# Altium project TRACTIAN-HW-Challenge.PrjPCB
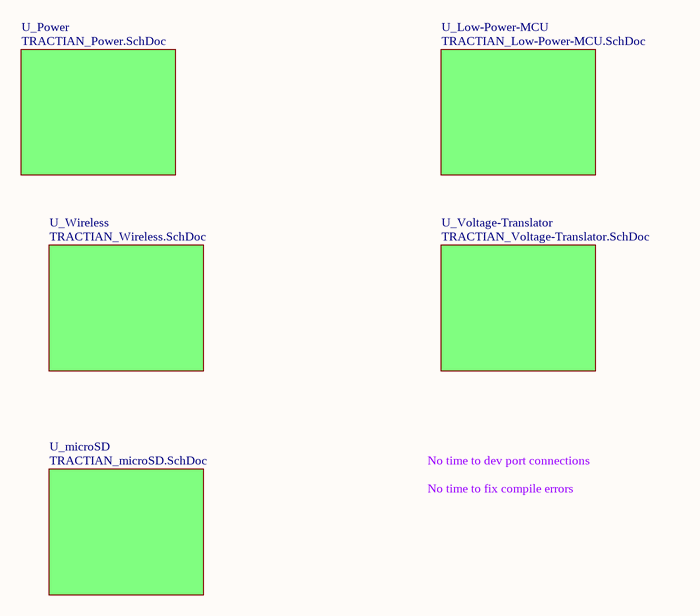
[diagram p0: Blocks.SchDoc]
6 sheets, 56 parts. Net scope: global (net labels, ports and power ports of the same name join across sheets).
Board file: TRACTIAN-HW-Challenge.PcbDoc
Sheets:
  Blocks.SchDoc
    U_Wireless = TRACTIAN_Wireless.SchDoc
    U_Voltage-Translator = TRACTIAN_Voltage-Translator.SchDoc
    U_Power = TRACTIAN_Power.SchDoc
    U_microSD = TRACTIAN_microSD.SchDoc
    U_Low-Power-MCU = TRACTIAN_Low-Power-MCU.SchDoc

## Sheet Blocks.SchDoc
size A

### Sub-sheets
U_Low-Power-MCU = TRACTIAN_Low-Power-MCU.SchDoc: no entries
U_microSD = TRACTIAN_microSD.SchDoc: no entries
U_Power = TRACTIAN_Power.SchDoc: no entries
U_Voltage-Translator = TRACTIAN_Voltage-Translator.SchDoc: no entries
U_Wireless = TRACTIAN_Wireless.SchDoc: no entries

### Notes on the sheet
- No time to dev port connections
- No time to fix compile errors

## Sheet TRACTIAN_Wireless.SchDoc
size A
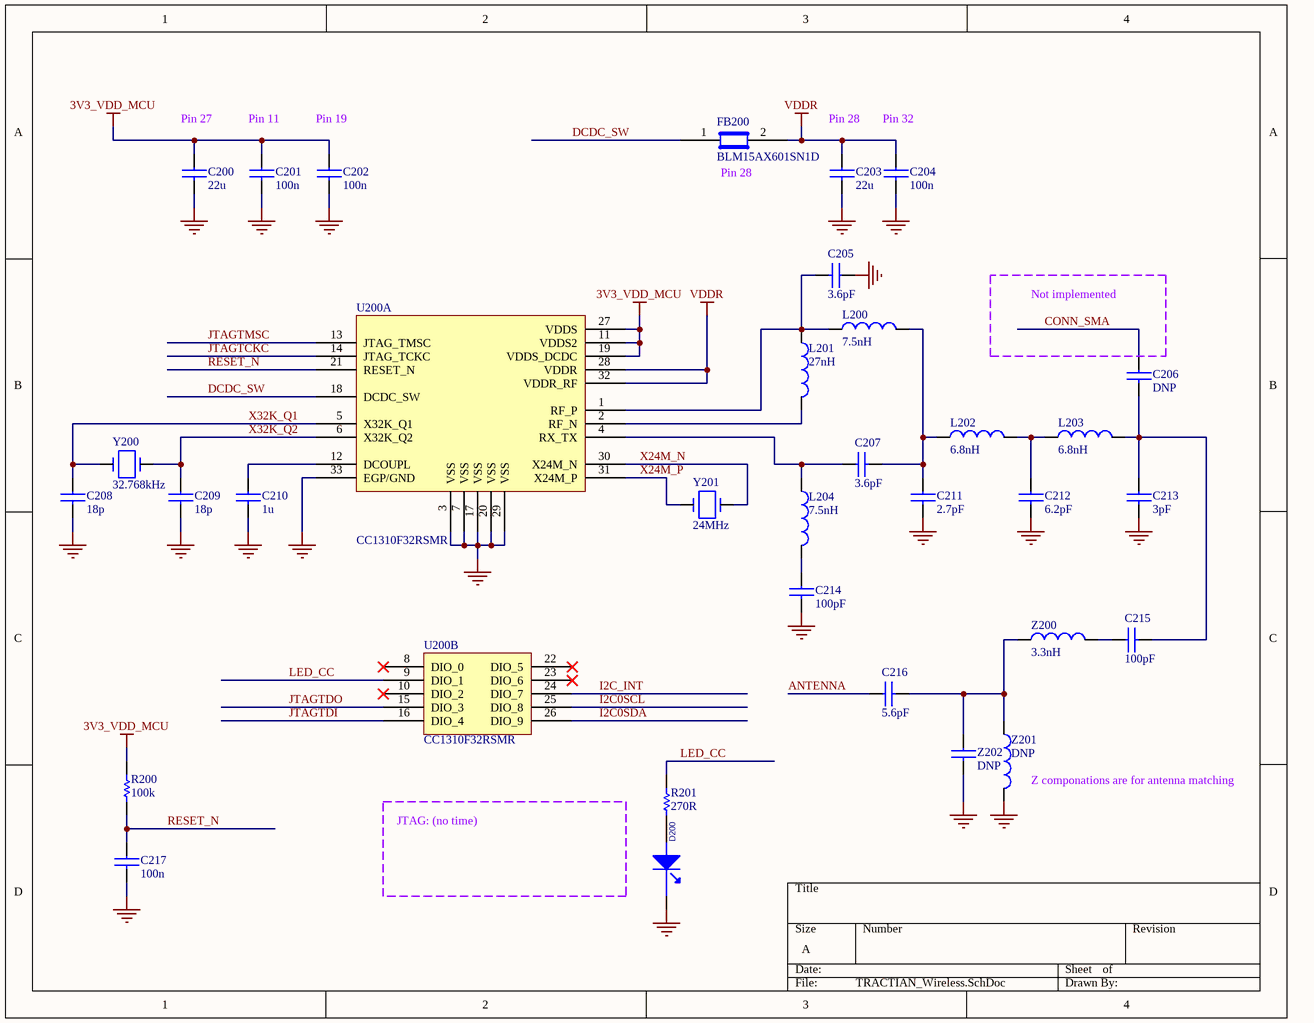
[diagram p1: TRACTIAN_Wireless.SchDoc]

### Parts
C200  22u  [C0805]
C201  100n  [C0402]
C202  100n  [C0402]
C203  22u  [C0805]
C204  100n  [C0402]
C205  3.6pF  [C0402]
C206  DNP  [C0402]
C207  3.6pF  [C0402]
C208  18p  [C0402]
C209  18p  [C0402]
C210  1u  [C0402]
C211  2.7pF  [C0402]
C212  6.2pF  [C0402]
C213  3pF  [C0402]
C214  100pF  [C0402]
C215  100pF  [C0402]
C216  5.6pF  [C0402]
C217  100n  [C0402]
D200  (no value)  [LED_0603]
FB200  BLM15AX601SN1D  [C0402]
L200  7.5nH  [L0402]
L201  27nH  [L0402]
L202  6.8nH  [L0402]
L203  6.8nH  [L0402]
L204  7.5nH  [L0402]
R200  100k  [R0402]
R201  270R  [R0402]
U200  CC1310F32RSMR  [VQFN-32]  (parts A,B of 2)
Y200  32.768kHz  [ABS06]
Y201  24MHz  [ABS06]
Z200  3.3nH  [L0402]
Z201  DNP  [L0402]
Z202  DNP  [C0402]

### Nets
3V3_VDD_MCU: C200.1 C201.1 C202.1 R200.2 U200.11(VDDS2) U200.19(VDDS_DCDC) U200.27(VDDS)
GND: C200.2 C201.2 C202.2 C203.2 C204.2 C205.1 C208.2 C209.2 C210.2 C211.2 C212.2 C213.2 C214.2 C217.2 D200.1(cathode) U200.3(VSS) U200.7(VSS) U200.17(VSS) U200.20(VSS) U200.29(VSS) U200.33(EGP/GND) Z201.2 Z202.2
VDDR: C203.1 C204.1 FB200.2 U200.28(VDDR) U200.32(VDDR_RF)
ANTENNA: C216.1
CONN_SMA: C206.1
DCDC_SW: FB200.1 U200.18(DCDC_SW)
I2C0SCL: U200.25(DIO_8)
I2C0SDA: U200.26(DIO_9)
I2C_INT: U200.24(DIO_7)
JTAGTCKC: U200.14(JTAG_TCKC)
JTAGTDI: U200.16(DIO_4)
JTAGTDO: U200.15(DIO_3)
JTAGTMSC: U200.13(JTAG_TMSC)
LED_CC: R201.2 U200.9(DIO_1)
RESET_N: C217.1 R200.1 U200.21(RESET_N)
X24M_N: U200.30(X24M_N) Y201.2
X24M_P: U200.31(X24M_P) Y201.1
X32K_Q1: C208.1 U200.5(X32K_Q1) Y200.1
X32K_Q2: C209.1 U200.6(X32K_Q2) Y200.2
NetC205_2: C205.2 L200.1 L201.1 U200.1(RF_P)
NetC206_2: C206.2 C213.1 C215.2 L203.2
NetC207_1: C207.1 L204.1 U200.4(RX_TX)
NetC207_2: C207.2 C211.1 L200.2 L202.1
NetC210_1: C210.1 U200.12(DCOUPL)
NetC212_1: C212.1 L202.2 L203.1
NetC214_1: C214.1 L204.2
NetC215_1: C215.1 Z200.2
NetC216_2: C216.2 Z200.1 Z201.1 Z202.1
NetD200_2: D200.2(ANODE) R201.1
NetL201_2: L201.2 U200.2(RF_N)

Not connected (* = marked no-connect by the designer): U200 8(DIO_0)* 10(DIO_2)* 22(DIO_5)* 23(DIO_6)*

### Notes on the sheet
- Pin 27
- Pin 11
- (near C202) Pin 19
- Pin 28
- Pin 32
- (near FB200) Pin 28
- Not implemented
- JTAG: (no time)
- (near Z201) Z componations are for antenna matching

### Library data of the parts
C200 C203 = C2012X5R1C226K: CAP CER 22UF 16V 10% X5R 0805; Manufacturer: TDK Corporation; Capacitance: 22µF; .Checked PCB: RF; Supplier 1: Digi-Key; Supplier Part Number 1: 445-6797-1-ND; Manufacturer Part Number: C2012X5R1C226K; RoHS: RoHS Compliant; Category: Capacitors; Stock 1: 15408; Pricing 1: 1=0.77, 10=0.737, 100=0.3575, 250=0.297, 500=0.2695, 1000=0.2475 (USD); Voltage - Rated: 16V; Tolerance: ±10%; Temperature Coefficient: X5R; Mounting Type: Surface Mount, MLCC; Operating Temperature: -55°C ~ 85°C; Applications: General Purpose; Ratings: -; Package / Case: 0805 (2012 Metric); Size / Dimension: 0.079" L x 0.049" W (2.00mm x 1.25mm); Height - Seated (Max): -; Thickness (Max): 0.057" (1.45mm); Lead Spacing: -; Features: -; Packaging: Cut Tape (CT); Lead Style: -; ComponentLink1URL: http://www.tdk.com/pdf/general_B11.pdf; ComponentLink1Description: http://www.tdk.com/pdf/general_B11.pdf; .Checked SCH: RF
C201 C202 C204 C217 = C1005X5R1H104K: CAP CER .10UF 50V X5R 10% 0402; Manufacturer: TDK Corporation; Capacitance: 0.1µF; Value: 100nF; .Checked PCB: used; Category: Capacitors; Supplier Part Number: 445-5942-1-ND; Manufacturer Part Number: C1005X5R1H104K; Operating Temperature: -55°C ~ 85°C; Package / Case: 0402 (1005 Metric); Price 1k [$]: 0.02340; .Checked SCH: used; Voltage - Rated: 50V; Supplier: Digikey; Supplier 1: Digi-Key; Supplier Part Number 1: 445-5942-1-ND; RoHS: RoHS Compliant; Stock 1: 106926; Pricing 1: 1=0.27, 10=0.18, 100=0.072, 250=0.05176, 500=0.0369, 1000=0.027 (USD); Tolerance: ±10%; Temperature Coefficient: X5R; Mounting Type: Surface Mount, MLCC; Applications: General Purpose; Ratings: -; Size / Dimension: 0.039" L x 0.020" W (1.00mm x 0.50mm); Height - Seated (Max): -; Thickness (Max): 0.022" (0.55mm); Lead Spacing: -; Features: -; Packaging: Cut Tape (CT); Lead Style: -; ComponentLink1URL: http://www.tdk.co.jp/tefe02/e412_c.pdf; ComponentLink1Description: http://www.tdk.co.jp/tefe02/e412_c.pdf
C205-C207 C211-C216 Z202 = Cap: CAPACITOR; ComponentLink1URL: http://www.vishay.com/doc?34104; ComponentLink1Description: http://www.vishay.com/doc?34104
  C205 C207: Value: 3.6pF
  C206 Z202: Value: DNP
  C211: Value: 2.7pF
  C212: Value: 6.2pF
  C213: Value: 3pF
  C214 C215: Value: 100pF
  C216: Value: 5.6pF
C208 C209 = C1005C0G1H180J: CAP CER 18PF 50V C0G 5% 0402; Manufacturer: TDK Corporation; .Checked PCB: used; Temperature Coefficient: C0G, NP0; Capacitance: 18pF; Category: Capacitors; Supplier Part Number: 445-1238-1-ND; Manufacturer Part Number: C1005C0G1H180J; Operating Temperature: -55°C ~ 125°C; Package / Case: 0402 (1005 Metric); Price 1k [$]: 0.00468; Value: 18pF; .Checked SCH: used; Voltage - Rated: 50V; Supplier: Digikey; Supplier 1: Digi-Key; Supplier Part Number 1: 445-1238-1-ND; RoHS: RoHS Compliant; Stock 1: 24321; Pricing 1: 1=0.08, 10=0.05, 100=0.018, 250=0.013, 500=0.0096, 1000=0.0065 (USD); Tolerance: ±5%; Mounting Type: Surface Mount, MLCC; Applications: General Purpose; Ratings: -; Size / Dimension: 0.039" L x 0.020" W (1.00mm x 0.50mm); Height - Seated (Max): -; Thickness (Max): 0.022" (0.55mm); Lead Spacing: -; Features: -; Packaging: Cut Tape (CT); Lead Style: -; ComponentLink1URL: http://www.tdk.co.jp/tefe02/e412_c.pdf; ComponentLink1Description: http://www.tdk.co.jp/tefe02/e412_c.pdf
C210 = C1005X5R1C105K: CAP CER 1.0UF 16V X5R 0402; Manufacturer: TDK Corporation; Capacitance: 1.0µF; Value: 1uF; .Checked PCB: used; Tolerance: ±10%; Category: Capacitors; Manufacturer Part Number: C1005X5R1C105K; Operating Temperature: -55°C ~ 85°C; Package / Case: 0402 (1005 Metric); Price 1k [$]: 0.02080; .Checked SCH: used; Voltage - Rated: 16V; Supplier Part Number: 445-4978-1-ND; Supplier: Digikey; Supplier 1: Digi-Key; Supplier Part Number 1: 445-4978-1-ND; RoHS: RoHS Compliant; Stock 1: 341010; Pricing 1: 1=0.24, 10=0.16, 100=0.064, 250=0.046, 500=0.0328, 1000=0.024 (USD); Temperature Coefficient: X5R; Mounting Type: Surface Mount, MLCC; Applications: General Purpose; Ratings: -; Size / Dimension: 0.039" L x 0.020" W (1.00mm x 0.50mm); Height - Seated (Max): -; Thickness (Max): 0.022" (0.55mm); Lead Spacing: -; Features: -; Packaging: Cut Tape (CT); Lead Style: -; ComponentLink1URL: http://www.tdk.co.jp/tefe02/e412_c.pdf; ComponentLink1Description: http://www.tdk.co.jp/tefe02/e412_c.pdf
D200 = LED: Generic LED 0603
FB200 = BLM15AX601SN1D: FERRITE CHIP 600 OHM 0402 420mA; Manufacturer: Murata Electronics North America; .Checked PCB: used; Impedance @ Frequency: 600 Ohm @ 100MHz; DC Resistance (DCR): 340 mOhm Max; Filter Type: Differential Mode - Single; Number of Lines: 1; .Checked SCH: used; Category: Filters; Supplier Part Number: 490-5441-1-ND; Manufacturer Part Number: BLM15AX601SN1D; Package / Case: 0402 (1005 Metric); Price 1k [$]: 0.03280; Value: BLM15AX601SN1D; Current Rating: 420mA; Supplier: Digikey; Supplier 1: Digi-Key; Supplier Part Number 1: 490-5441-1-ND; RoHS: RoHS Compliant; Stock 1: 34008; Pricing 1: 1=0.26, 10=0.197, 50=0.1148, 100=0.0918, 250=0.0656, 500=0.0446, 1000=0.03608, 5000=0.02821 (USD); Mounting Type: Surface Mount; Packaging: Cut Tape (CT); Height (Max): 0.022" (0.55mm); Size / Dimension: 0.039" L x 0.020" W (1.00mm x 0.50mm); ComponentLink1URL: http://search.murata.co.jp/Ceramy/image/img/PDF/ENG/L0110S0100BLM15AX_SN.pdf; ComponentLink1Description: http://search.murata.co.jp/Ceramy/image/img/PDF/ENG/L0110S0100BLM15AX_SN.pdf
L200-L204 Z200 Z201 = Ind: INDUCTOR; ComponentLink1URL: http://www.vishay.com/doc?34104; ComponentLink1Description: http://www.vishay.com/doc?34104
  L200 L204: Value: 7.5nH
  L201: Value: 27nH
  L202 L203: Value: 6.8nH
  Z200: Value: 3.3nH
  Z201: Value: DNP
R200 = RMCF0402FT100K: RES 100K OHM 1/16W 1% 0402 SMD; Manufacturer: Stackpole Electronics Inc; Power (Watts): 0.063W, 1/16W; .Checked PCB: used; Temperature Coefficient: ±100ppm/°C; Category: Resistors; Supplier Part Number: RMCF0402FT100KCT-ND; Manufacturer Part Number: RMCF0402FT100K; Package / Case: 0402 (1005 Metric); Price 1k [$]: 0.00384; Resistance (Ohms): 100K; Tolerance: ±1%; Value: 100k; .Checked SCH: used; Supplier: Digikey; Supplier 1: Digi-Key; Supplier Part Number 1: RMCF0402FT100KCT-ND; RoHS: RoHS Compliant; Stock 1: 95; Pricing 1: 1=0.04, 10=0.025, 50=0.0138, 100=0.0105, 250=0.0078, 500=0.00576, 1000=0.00384 (USD); Composition: Thick Film; Features: -; Size / Dimension: 0.039" L x 0.020" W (1.00mm x 0.50mm); Height: 0.016" (0.40mm); Number of Terminations: 2; Packaging: Cut Tape (CT); ComponentLink1URL: http://www.seielect.com/Catalog/SEI-RMCF.pdf; ComponentLink1Description: http://www.seielect.com/Catalog/SEI-RMCF.pdf
R201 = Res: Generic resistor; Value: 270R
U200 = CC1310F32RSMR: CC1310 SimpleLink™ Ultra-Low-Power Sub-1 GHz Wireless MCU; Manufacturer Name: Texas Instruments; PN: CC1310F32RGZR; Digikey PN: 296-50997-1-ND; Mouser PN: 595-CC1310F32RGZR
Y200 = ABS06-32.768KHZ-9-1-T: CRYSTAL 32.768 KHZ 9.0 PF SMD; Manufacturer: Abracon Corporation; .Checked PCB: used; Frequency Stability: ±10ppm; Load Capacitance: 9pF; Operating Mode: Fundamental; .Checked SCH: used; Category: Crystals and Oscillators; Supplier Part Number: 535-10247-1-ND; Manufacturer Part Number: ABS06-32.768KHZ-9-1-T; Operating Temperature: -40°C ~ 85°C; Package / Case: 2-SMD, No Lead (DFN, LCC); Price 1k [$]: 1.24500; Value: 32.768kHz; Frequency: 32.768kHz; Supplier: Digikey; Supplier 1: Digi-Key; Supplier Part Number 1: 535-10247-1-ND; RoHS: RoHS Compliant; Stock 1: 5693; Pricing 1: 1=2.81, 10=2.438, 50=2.1376, 100=1.6875, 500=1.425 (USD); Type: kHz Crystal (Tuning Fork); Frequency Tolerance: ±10ppm; Mounting Type: Surface Mount; Size / Dimension: 0.079" L x 0.047" W (2.00mm x 1.20mm); Height: 0.024" (0.60mm); Packaging: Cut Tape (CT); ComponentLink1URL: http://www.abracon.com/Resonators/ABS06.pdf; ComponentLink1Description: http://www.abracon.com/Resonators/ABS06.pdf
Y201 = ABM7-24.000MHZ-D-2-Y-T: CRYSTAL 24.0000MHZ 18PF SMD; Manufacturer: Abracon Corporation; Frequency Stability: ±30ppm; Frequency Tolerance: ±20ppm; ESR (Equivalent Series Resistance): 50 Ohm; Operating Mode: Fundamental; .Creator: MM; .Checked PCB: RF, used by MM; .Checked SCH: MM, checked by RF; Supplier 1: Digi-Key; Manufacturer Part Number: ABM7-24.000MHZ-D-2-Y-T; RoHS: RoHS Compliant; Category: Crystals and Oscillators; Stock 1: 53059; Pricing 1: 1=1.31, 10=1.138, 50=0.9976, 100=0.7875, 500=0.665 (USD); Type: MHz Crystal; Frequency: 24MHz; Load Capacitance: 18pF; Operating Temperature: -40°C ~ 85°C; Ratings: -; Mounting Type: Surface Mount; Package / Case: 2-SMD; Size / Dimension: 0.236" L x 0.138" W (6.00mm x 3.50mm); Height: 0.055" (1.40mm); Packaging: Cut Tape (CT); ComponentLink1URL: http://www.abracon.com/Resonators/abm7.pdf; ComponentLink1Description: http://www.abracon.com/Resonators/abm7.pdf; Supplier Part Number 1: 535-9845-1-ND

## Sheet TRACTIAN_Voltage-Translator.SchDoc
size A

## Sheet TRACTIAN_Power.SchDoc
size A
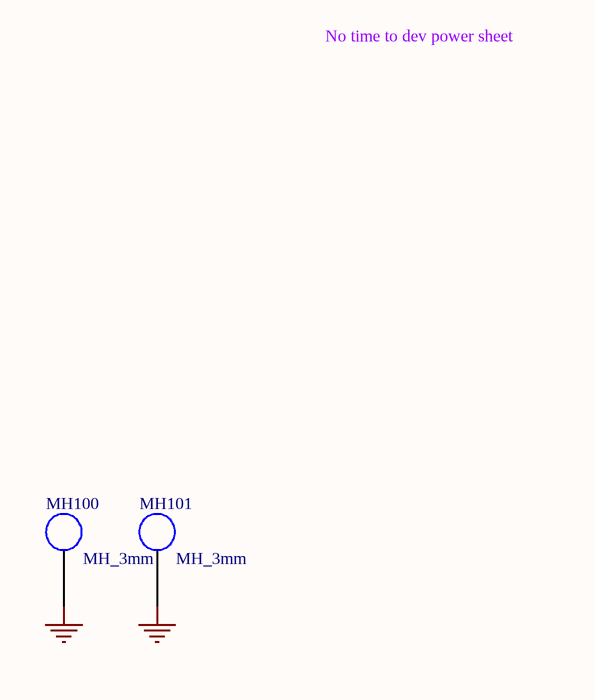
[diagram p2: TRACTIAN_Power.SchDoc]

### Parts
MH100  MH_3mm  [MH_3mm]
MH101  MH_3mm  [MH_3mm]

### Nets
GND: MH100.1(MH) MH101.1(MH)

### Notes on the sheet
- No time to dev power sheet

## Sheet TRACTIAN_microSD.SchDoc
size A
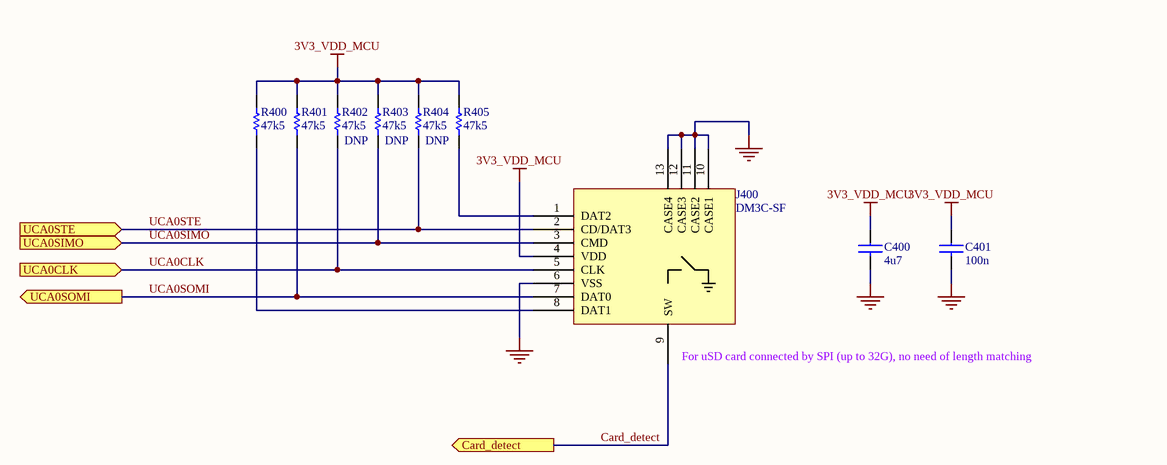
[diagram p3: TRACTIAN_microSD.SchDoc]

### Parts
C400  4u7  [C0402]
C401  100n  [C0402]
J400  DM3C-SF  [uSD_DM3CS]
R400  47k5  [R0402]
R401  47k5  [R0402]
R402  47k5  Assembly: DNP  [R0402]
R403  47k5  Assembly: DNP  [R0402]
R404  47k5  Assembly: DNP  [R0402]
R405  47k5  [R0402]

### Ports
Card_detect (out), UCA0CLK (in), UCA0SIMO (in), UCA0SOMI (out), UCA0STE (in)

### Nets
3V3_VDD_MCU: C400.1 C401.1 J400.4(VDD) R400.2 R401.2 R402.2 R403.2 R404.2 R405.2
GND: C400.2 C401.2 J400.6(VSS) J400.10(CASE1) J400.11(CASE2) J400.12(CASE3) J400.13(CASE4)
Card_detect: J400.9(SW) ; port Card_detect
UCA0CLK: J400.5(CLK) R402.1 ; port UCA0CLK
UCA0SIMO: J400.3(CMD) R403.1 ; port UCA0SIMO
UCA0SOMI: J400.7(DAT0) R401.1 ; port UCA0SOMI
UCA0STE: J400.2(CD/DAT3) R404.1 ; port UCA0STE
NetJ400_1: J400.1(DAT2) R405.1
NetJ400_8: J400.8(DAT1) R400.1

### Notes on the sheet
- (near J400) For uSD card connected by SPI (up to 32G), no need of length matching

### Library data of the parts
C400 = C1005X5R1A475M: CAP CER 4.7UF 10V 20% X5R 0402; Manufacturer: TDK Corporation; Capacitance: 4.7µF; .Checked PCB: RF; Supplier 1: Digi-Key; Supplier Part Number 1: 445-8023-1-ND; Manufacturer Part Number: C1005X5R1A475M; RoHS: RoHS Compliant; Category: Capacitors; Stock 1: 10140; Pricing 1: 1=0.53, 10=0.415, 100=0.25, 250=0.18752, 500=0.16, 1000=0.125, 5000=0.095 (USD); Voltage - Rated: 10V; Tolerance: ±20%; Temperature Coefficient: X5R; Mounting Type: Surface Mount, MLCC; Operating Temperature: -55°C ~ 85°C; Applications: General Purpose; Ratings: -; Package / Case: 0402 (1005 Metric); Size / Dimension: 0.039" L x 0.020" W (1.00mm x 0.50mm); Height - Seated (Max): -; Thickness (Max): -; Lead Spacing: -; Features: -; Packaging: Cut Tape (CT); Lead Style: -; ComponentLink1URL: http://www.tdk.com/pdf/general_B11.pdf; ComponentLink1Description: http://www.tdk.com/pdf/general_B11.pdf; .Checked SCH: RF
C401 = C1005X5R1H104K: as C201 on sheet TRACTIAN_Wireless; Category: Capacitors; Supplier Part Number: 445-5942-1-ND; Manufacturer Part Number: C1005X5R1H104K; Operating Temperature: -55°C ~ 85°C; Package / Case: 0402 (1005 Metric); Price 1k [$]: 0.02340; .Checked SCH: used; Voltage - Rated: 50V; Supplier: Digikey; Supplier 1: Digi-Key; Supplier Part Number 1: 445-5942-1-ND; RoHS: RoHS Compliant; Stock 1: 106926; Pricing 1: 1=0.27, 10=0.18, 100=0.072, 250=0.05176, 500=0.0369, 1000=0.027 (USD); Tolerance: ±10%; Temperature Coefficient: X5R; Mounting Type: Surface Mount, MLCC; Applications: General Purpose; Ratings: -; Size / Dimension: 0.039" L x 0.020" W (1.00mm x 0.50mm); Height - Seated (Max): -; Thickness (Max): 0.022" (0.55mm); Lead Spacing: -; Features: -; Packaging: Cut Tape (CT); Lead Style: -; ComponentLink1URL: http://www.tdk.co.jp/tefe02/e412_c.pdf; ComponentLink1Description: http://www.tdk.co.jp/tefe02/e412_c.pdf
J400 = DM3C-SF: CONN MICRO SD R/A HING TYPE SMD; Manufacturer: Hirose Electric Co Ltd; Card Type: Secure Digital - microSD™; Number of Positions: 10 (8 + 2); Connector Type: Connector and Ejector; Insertion, Removal Method: Hinged Lid; .Creator: MM; Supplier 1: Digi-Key; Manufacturer Part Number: DM3C-SF; RoHS: RoHS Compliant; Category: Connectors, Interconnects; Stock 1: 87; Pricing 1: 1=2.36, 10=1.96, 25=1.8152, 50=1.6368, 100=1.452, 250=1.2738, 500=1.1616 (USD); Packaging: Cut Tape (CT); Ejector Side: -; Mounting Type: Surface Mount, Right Angle; Features: Switch; Height Above Board: 0.072" (1.83mm); Mounting Feature: Normal, Standard - Top; Contact Finish: Gold; Contact Finish Thickness: -; ComponentLink1URL: http://www.hirose.co.jp/cataloge_hp/e60900232.pdf; ComponentLink1Description: http://www.hirose.co.jp/cataloge_hp/e60900232.pdf; Supplier Part Number 1: HR1940CT-ND; .Checked PCB: MM; .Checked SCH: MM
R400-R405 = RC0402FR-0747K5L: RES 47.5K OHM 1/16W 1% 0402 SMD; Manufacturer: Yageo; Power (Watts): 0.063W, 1/16W; Temperature Coefficient: ±100ppm/°C; .Checked PCB: RF; Supplier 1: Digi-Key; Supplier Part Number 1: 311-47.5KLRCT-ND; Manufacturer Part Number: RC0402FR-0747K5L; RoHS: RoHS Compliant; Category: Resistors; Stock 1: 59607; Pricing 1: 10=0.014, 100=0.0063, 500=0.00382, 1000=0.0027, 5000=0.00203 (USD); Resistance (Ohms): 47.5K; Composition: Thick Film; Features: -; Tolerance: ±1%; Package / Case: 0402 (1005 Metric); Size / Dimension: 0.039" L x 0.020" W (1.00mm x 0.50mm); Height: 0.016" (0.40mm); Number of Terminations: 2; Packaging: Cut Tape (CT); ComponentLink1URL: http://www.yageo.com/documents/recent/PYu-RC0402_51_RoHS_L_6.pdf; ComponentLink1Description: http://www.yageo.com/documents/recent/PYu-RC0402_51_RoHS_L_6.pdf; .Checked SCH: RF
  R400 R401 R405: Assembly: *

## Sheet TRACTIAN_Low-Power-MCU.SchDoc
size A
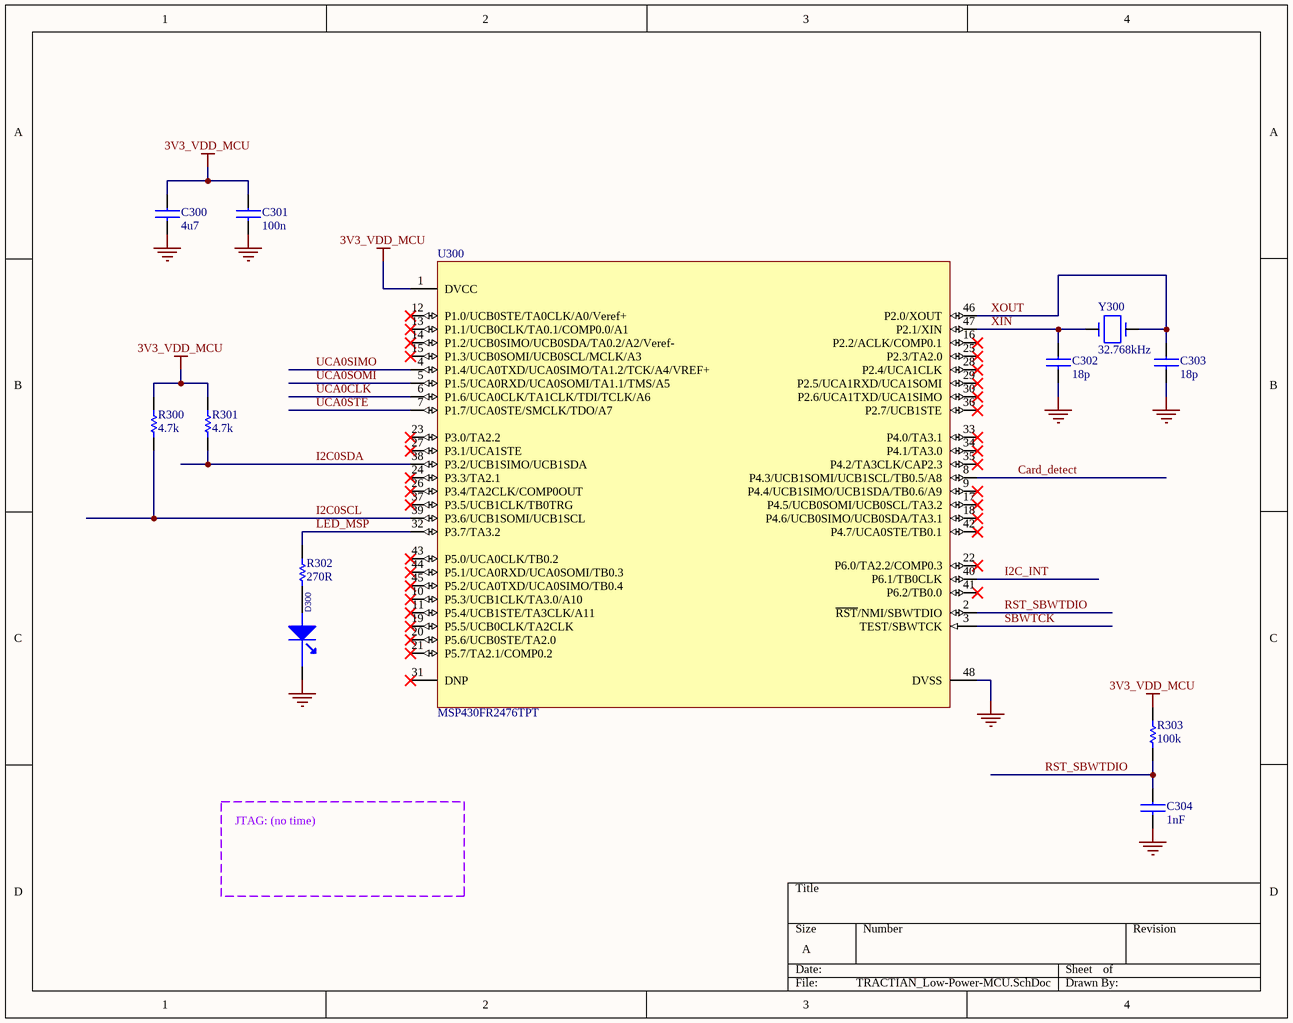
[diagram p4: TRACTIAN_Low-Power-MCU.SchDoc]

### Parts
C300  4u7  [C0402]
C301  100n  [C0402]
C302  18p  [C0402]
C303  18p  [C0402]
C304  1nF  [C0402]
D300  (no value)  [LED_0603]
R300  4.7k  [R0402]
R301  4.7k  [R0402]
R302  270R  [R0402]
R303  100k  [R0402]
U300  MSP430FR2476TPT  [LQFP-48]
Y300  32.768kHz  [ABS06]

### Nets
3V3_VDD_MCU: C300.1 C301.1 R300.2 R301.2 R303.2 U300.1(DVCC)
GND: C300.2 C301.2 C302.2 C303.2 C304.2 D300.1(cathode) U300.48(DVSS)
Card_detect: U300.8(P4.3/UCB1SOMI/UCB1SCL/TB0.5/A8)
I2C0SCL: R300.1 U300.39(P3.6/UCB1SOMI/UCB1SCL)
I2C0SDA: R301.1 U300.38(P3.2/UCB1SIMO/UCB1SDA)
I2C_INT: U300.40(P6.1/TB0CLK)
LED_MSP: R302.2 U300.32(P3.7/TA3.2)
RST_SBWTDIO: C304.1 R303.1 U300.2(~{RST}/NMI/SBWTDIO)
SBWTCK: U300.3(TEST/SBWTCK)
UCA0CLK: U300.6(P1.6/UCA0CLK/TA1CLK/TDI/TCLK/A6)
UCA0SIMO: U300.4(P1.4/UCA0TXD/UCA0SIMO/TA1.2/TCK/A4/VREF+)
UCA0SOMI: U300.5(P1.5/UCA0RXD/UCA0SOMI/TA1.1/TMS/A5)
UCA0STE: U300.7(P1.7/UCA0STE/SMCLK/TDO/A7)
XIN: C302.1 U300.47(P2.1/XIN) Y300.1
XOUT: C303.1 U300.46(P2.0/XOUT) Y300.2
NetD300_2: D300.2(ANODE) R302.1

Not connected (* = marked no-connect by the designer): U300 9(P4.4/UCB1SIMO/UCB1SDA/TB0.6/A9)* 10(P5.3/UCB1CLK/TA3.0/A10)* 11(P5.4/UCB1STE/TA3CLK/A11)* 12(P1.0/UCB0STE/TA0CLK/A0/Veref+)* 13(P1.1/UCB0CLK/TA0.1/COMP0.0/A1)* 14(P1.2/UCB0SIMO/UCB0SDA/TA0.2/A2/Veref-)* 15(P1.3/UCB0SOMI/UCB0SCL/MCLK/A3)* 16(P2.2/ACLK/COMP0.1)* 17(P4.5/UCB0SOMI/UCB0SCL/TA3.2)* 18(P4.6/UCB0SIMO/UCB0SDA/TA3.1)* 19(P5.5/UCB0CLK/TA2CLK)* 20(P5.6/UCB0STE/TA2.0)* 21(P5.7/TA2.1/COMP0.2)* 22(P6.0/TA2.2/COMP0.3)* 23(P3.0/TA2.2)* 24(P3.3/TA2.1)* 25(P2.3/TA2.0)* 26(P3.4/TA2CLK/COMP0OUT)* 27(P3.1/UCA1STE)* 28(P2.4/UCA1CLK)* 29(P2.5/UCA1RXD/UCA1SOMI)* 30(P2.6/UCA1TXD/UCA1SIMO)* 31(DNP)* 33(P4.0/TA3.1)* 34(P4.1/TA3.0)* 35(P4.2/TA3CLK/CAP2.3)* 36(P2.7/UCB1STE)* 37(P3.5/UCB1CLK/TB0TRG)* 41(P6.2/TB0.0)* 42(P4.7/UCA0STE/TB0.1)* 43(P5.0/UCA0CLK/TB0.2)* 44(P5.1/UCA0RXD/UCA0SOMI/TB0.3)* 45(P5.2/UCA0TXD/UCA0SIMO/TB0.4)*

### Notes on the sheet
- JTAG: (no time)

### Library data of the parts
C300 = C1005X5R1A475M: as C400 on sheet TRACTIAN_microSD; Supplier 1: Digi-Key; Supplier Part Number 1: 445-8023-1-ND; Manufacturer Part Number: C1005X5R1A475M; RoHS: RoHS Compliant; Category: Capacitors; Stock 1: 10140; Pricing 1: 1=0.53, 10=0.415, 100=0.25, 250=0.18752, 500=0.16, 1000=0.125, 5000=0.095 (USD); Voltage - Rated: 10V; Tolerance: ±20%; Temperature Coefficient: X5R; Mounting Type: Surface Mount, MLCC; Operating Temperature: -55°C ~ 85°C; Applications: General Purpose; Ratings: -; Package / Case: 0402 (1005 Metric); Size / Dimension: 0.039" L x 0.020" W (1.00mm x 0.50mm); Height - Seated (Max): -; Thickness (Max): -; Lead Spacing: -; Features: -; Packaging: Cut Tape (CT); Lead Style: -; ComponentLink1URL: http://www.tdk.com/pdf/general_B11.pdf; ComponentLink1Description: http://www.tdk.com/pdf/general_B11.pdf; .Checked SCH: RF
C301 = C1005X5R1H104K: as C201 on sheet TRACTIAN_Wireless; Category: Capacitors; Supplier Part Number: 445-5942-1-ND; Manufacturer Part Number: C1005X5R1H104K; Operating Temperature: -55°C ~ 85°C; Package / Case: 0402 (1005 Metric); Price 1k [$]: 0.02340; .Checked SCH: used; Voltage - Rated: 50V; Supplier: Digikey; Supplier 1: Digi-Key; Supplier Part Number 1: 445-5942-1-ND; RoHS: RoHS Compliant; Stock 1: 106926; Pricing 1: 1=0.27, 10=0.18, 100=0.072, 250=0.05176, 500=0.0369, 1000=0.027 (USD); Tolerance: ±10%; Temperature Coefficient: X5R; Mounting Type: Surface Mount, MLCC; Applications: General Purpose; Ratings: -; Size / Dimension: 0.039" L x 0.020" W (1.00mm x 0.50mm); Height - Seated (Max): -; Thickness (Max): 0.022" (0.55mm); Lead Spacing: -; Features: -; Packaging: Cut Tape (CT); Lead Style: -; ComponentLink1URL: http://www.tdk.co.jp/tefe02/e412_c.pdf; ComponentLink1Description: http://www.tdk.co.jp/tefe02/e412_c.pdf
C302 C303 = C1005C0G1H180J: as C208 on sheet TRACTIAN_Wireless; Capacitance: 18pF; Category: Capacitors; Supplier Part Number: 445-1238-1-ND; Manufacturer Part Number: C1005C0G1H180J; Operating Temperature: -55°C ~ 125°C; Package / Case: 0402 (1005 Metric); Price 1k [$]: 0.00468; Value: 18pF; .Checked SCH: used; Voltage - Rated: 50V; Supplier: Digikey; Supplier 1: Digi-Key; Supplier Part Number 1: 445-1238-1-ND; RoHS: RoHS Compliant; Stock 1: 24321; Pricing 1: 1=0.08, 10=0.05, 100=0.018, 250=0.013, 500=0.0096, 1000=0.0065 (USD); Tolerance: ±5%; Mounting Type: Surface Mount, MLCC; Applications: General Purpose; Ratings: -; Size / Dimension: 0.039" L x 0.020" W (1.00mm x 0.50mm); Height - Seated (Max): -; Thickness (Max): 0.022" (0.55mm); Lead Spacing: -; Features: -; Packaging: Cut Tape (CT); Lead Style: -; ComponentLink1URL: http://www.tdk.co.jp/tefe02/e412_c.pdf; ComponentLink1Description: http://www.tdk.co.jp/tefe02/e412_c.pdf
C304 = Cap: CAPACITOR; ComponentLink1URL: http://www.vishay.com/doc?34104; ComponentLink1Description: http://www.vishay.com/doc?34104; Value: 1nF
D300 = LED: Generic LED 0603
R300-R302 = Res: Generic resistor
  R300 R301: Value: 4.7k
  R302: Value: 270R
R303 = RMCF0402FT100K: as R200 on sheet TRACTIAN_Wireless; Category: Resistors; Supplier Part Number: RMCF0402FT100KCT-ND; Manufacturer Part Number: RMCF0402FT100K; Package / Case: 0402 (1005 Metric); Price 1k [$]: 0.00384; Resistance (Ohms): 100K; Tolerance: ±1%; Value: 100k; .Checked SCH: used; Supplier: Digikey; Supplier 1: Digi-Key; Supplier Part Number 1: RMCF0402FT100KCT-ND; RoHS: RoHS Compliant; Stock 1: 95; Pricing 1: 1=0.04, 10=0.025, 50=0.0138, 100=0.0105, 250=0.0078, 500=0.00576, 1000=0.00384 (USD); Composition: Thick Film; Features: -; Size / Dimension: 0.039" L x 0.020" W (1.00mm x 0.50mm); Height: 0.016" (0.40mm); Number of Terminations: 2; Packaging: Cut Tape (CT); ComponentLink1URL: http://www.seielect.com/Catalog/SEI-RMCF.pdf; ComponentLink1Description: http://www.seielect.com/Catalog/SEI-RMCF.pdf
U300 = MSP430FR2476TPT: MCU 16-BIT ULTRA-LOW-POWER MSP430FR2476TPT LQFP-48; Mouser PN: 595-MSP430FR2476TPT; Digikey PN: 296-MSP430FR2476TPTTR-ND; PN: MSP430FR2476TPT; Manufacturer Name: *
Y300 = ABS06-32.768KHZ-9-1-T: as Y200 on sheet TRACTIAN_Wireless; .Checked SCH: used; Category: Crystals and Oscillators; Supplier Part Number: 535-10247-1-ND; Manufacturer Part Number: ABS06-32.768KHZ-9-1-T; Operating Temperature: -40°C ~ 85°C; Package / Case: 2-SMD, No Lead (DFN, LCC); Price 1k [$]: 1.24500; Value: 32.768kHz; Frequency: 32.768kHz; Supplier: Digikey; Supplier 1: Digi-Key; Supplier Part Number 1: 535-10247-1-ND; RoHS: RoHS Compliant; Stock 1: 5693; Pricing 1: 1=2.81, 10=2.438, 50=2.1376, 100=1.6875, 500=1.425 (USD); Type: kHz Crystal (Tuning Fork); Frequency Tolerance: ±10ppm; Mounting Type: Surface Mount; Size / Dimension: 0.079" L x 0.047" W (2.00mm x 1.20mm); Height: 0.024" (0.60mm); Packaging: Cut Tape (CT); ComponentLink1URL: http://www.abracon.com/Resonators/ABS06.pdf; ComponentLink1Description: http://www.abracon.com/Resonators/ABS06.pdf

## Nets that join several sheets
3V3_VDD_MCU: TRACTIAN_Wireless (7 pins), TRACTIAN_microSD (9 pins), TRACTIAN_Low-Power-MCU (6 pins)
GND: TRACTIAN_Wireless (23 pins), TRACTIAN_Power (MH100.1 MH101.1), TRACTIAN_microSD (7 pins), TRACTIAN_Low-Power-MCU (7 pins)
Card_detect: TRACTIAN_microSD (J400.9), TRACTIAN_Low-Power-MCU (U300.8)
I2C0SCL: TRACTIAN_Wireless (U200.25), TRACTIAN_Low-Power-MCU (R300.1 U300.39)
I2C0SDA: TRACTIAN_Wireless (U200.26), TRACTIAN_Low-Power-MCU (R301.1 U300.38)
I2C_INT: TRACTIAN_Wireless (U200.24), TRACTIAN_Low-Power-MCU (U300.40)
UCA0CLK: TRACTIAN_microSD (J400.5 R402.1), TRACTIAN_Low-Power-MCU (U300.6)
UCA0SIMO: TRACTIAN_microSD (J400.3 R403.1), TRACTIAN_Low-Power-MCU (U300.4)
UCA0SOMI: TRACTIAN_microSD (J400.7 R401.1), TRACTIAN_Low-Power-MCU (U300.5)
UCA0STE: TRACTIAN_microSD (J400.2 R404.1), TRACTIAN_Low-Power-MCU (U300.7)